# Altium schematic sheet Mandelbrot.SchDoc
size A; DocumentNumber: 1; SheetNumber: 1; SheetTotal: 1
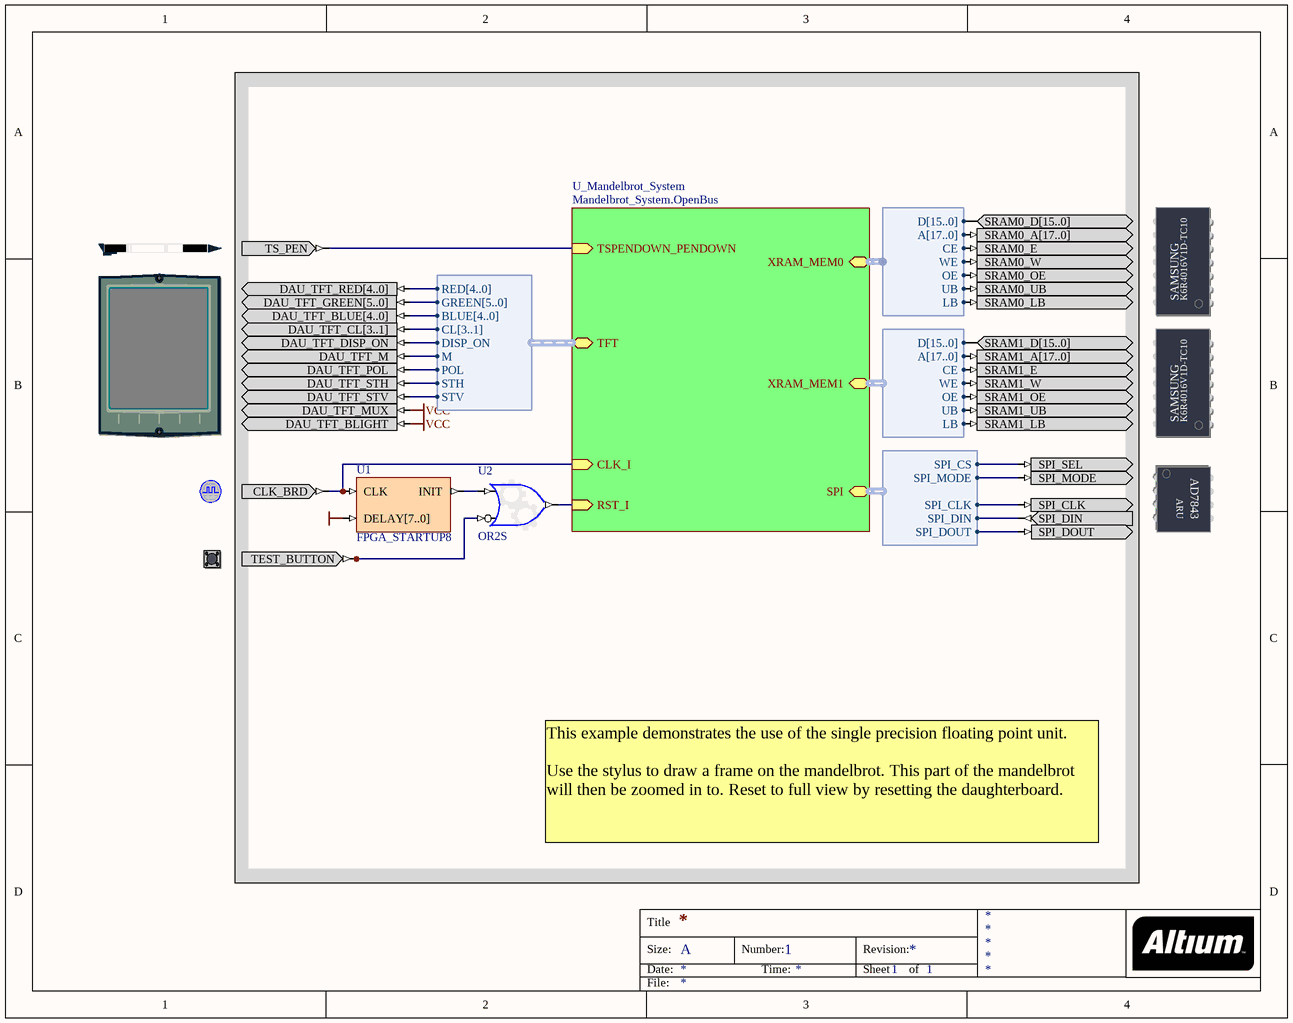
[diagram p0: Mandelbrot.SchDoc]

## Parts
(Parts that share a designator on the sheet are numbered #1, #2 ... from top to bottom, then left to right.)
?#1  SRAM_DAUGHTER0  (value not drawn)
?#2  TOUCHSCREEN_PEN_DOWN  (value not drawn)
?#3  TFT_LCD  (value not drawn)
?#4  SRAM_DAUGHTER1  (value not drawn)
?#5  CLOCK_BOARD  (value not drawn)
?#6  TEST_BUTTON  (value not drawn)
?#7  TOUCH_SCREEN_DIGITIZER  (value not drawn)
U1  FPGA_STARTUP8
U2  OR2S

## Sub-sheets
U_Mandelbrot_System = Mandelbrot_System.OpenBus: RST_I (in), CLK_I (in), XRAM_MEM1 (harness WB_MEM_CTRL_SRAM16_A18), XRAM_MEM0 (harness WB_MEM_CTRL_SRAM16_A18), TSPENDOWN_PENDOWN (in), SPI (harness SPI_W_NB), TFT (harness VGA32_TFT)

## Harnesses
WB_MEM_CTRL_SRAM16_A18: D[15..0], A[17..0], CE, WE, OE, UB, LB
VGA32_TFT: RED[4..0], GREEN[5..0], BLUE[4..0], CL[3..1], DISP_ON, M, POL, STH, STV
SPI_W_NB: SPI_DOUT, SPI_DIN, SPI_CLK, SPI_MODE, SPI_CS

## Nets
VCC: ?#3.DAU_TFT_BLIGHT ?#3.DAU_TFT_MUX
VCCBUS[..]: U1.DELAY[7..0]
Net?#1_SRAM0_A[17..0]: ?#1.SRAM0_A[17..0] ; sheet U_Mandelbrot_System/XRAM_MEM0.A[17..0]
Net?#1_SRAM0_D[15..0]: ?#1.SRAM0_D[15..0] ; sheet U_Mandelbrot_System/XRAM_MEM0.D[15..0]
Net?#1_SRAM0_E: ?#1.SRAM0_E ; sheet U_Mandelbrot_System/XRAM_MEM0.CE
Net?#1_SRAM0_LB: ?#1.SRAM0_LB ; sheet U_Mandelbrot_System/XRAM_MEM0.LB
Net?#1_SRAM0_OE: ?#1.SRAM0_OE ; sheet U_Mandelbrot_System/XRAM_MEM0.OE
Net?#1_SRAM0_UB: ?#1.SRAM0_UB ; sheet U_Mandelbrot_System/XRAM_MEM0.UB
Net?#1_SRAM0_W: ?#1.SRAM0_W ; sheet U_Mandelbrot_System/XRAM_MEM0.WE
Net?#2_TS_PEN: ?#2.TS_PEN ; sheet U_Mandelbrot_System/TSPENDOWN_PENDOWN
Net?#3_DAU_TFT_BLUE[4..0]: ?#3.DAU_TFT_BLUE[4..0] ; sheet U_Mandelbrot_System/TFT.BLUE[4..0]
Net?#3_DAU_TFT_CL[3..1]: ?#3.DAU_TFT_CL[3..1] ; sheet U_Mandelbrot_System/TFT.CL[3..1]
Net?#3_DAU_TFT_DISP_ON: ?#3.DAU_TFT_DISP_ON ; sheet U_Mandelbrot_System/TFT.DISP_ON
Net?#3_DAU_TFT_GREEN[5..0]: ?#3.DAU_TFT_GREEN[5..0] ; sheet U_Mandelbrot_System/TFT.GREEN[5..0]
Net?#3_DAU_TFT_M: ?#3.DAU_TFT_M ; sheet U_Mandelbrot_System/TFT.M
Net?#3_DAU_TFT_POL: ?#3.DAU_TFT_POL ; sheet U_Mandelbrot_System/TFT.POL
Net?#3_DAU_TFT_RED[4..0]: ?#3.DAU_TFT_RED[4..0] ; sheet U_Mandelbrot_System/TFT.RED[4..0]
Net?#3_DAU_TFT_STH: ?#3.DAU_TFT_STH ; sheet U_Mandelbrot_System/TFT.STH
Net?#3_DAU_TFT_STV: ?#3.DAU_TFT_STV ; sheet U_Mandelbrot_System/TFT.STV
Net?#4_SRAM1_A[17..0]: ?#4.SRAM1_A[17..0] ; sheet U_Mandelbrot_System/XRAM_MEM1.A[17..0]
Net?#4_SRAM1_D[15..0]: ?#4.SRAM1_D[15..0] ; sheet U_Mandelbrot_System/XRAM_MEM1.D[15..0]
Net?#4_SRAM1_E: ?#4.SRAM1_E ; sheet U_Mandelbrot_System/XRAM_MEM1.CE
Net?#4_SRAM1_LB: ?#4.SRAM1_LB ; sheet U_Mandelbrot_System/XRAM_MEM1.LB
Net?#4_SRAM1_OE: ?#4.SRAM1_OE ; sheet U_Mandelbrot_System/XRAM_MEM1.OE
Net?#4_SRAM1_UB: ?#4.SRAM1_UB ; sheet U_Mandelbrot_System/XRAM_MEM1.UB
Net?#4_SRAM1_W: ?#4.SRAM1_W ; sheet U_Mandelbrot_System/XRAM_MEM1.WE
Net?#5_CLK_BRD: ?#5.CLK_BRD U1.CLK ; sheet U_Mandelbrot_System/CLK_I
Net?#6_TEST_BUTTON: ?#6.TEST_BUTTON U2.I1
Net?#7_SPI_CLK: ?#7.SPI_CLK ; sheet U_Mandelbrot_System/SPI.SPI_CLK
Net?#7_SPI_DIN: ?#7.SPI_DIN ; sheet U_Mandelbrot_System/SPI.SPI_DIN
Net?#7_SPI_DOUT: ?#7.SPI_DOUT ; sheet U_Mandelbrot_System/SPI.SPI_DOUT
Net?#7_SPI_MODE: ?#7.SPI_MODE ; sheet U_Mandelbrot_System/SPI.SPI_MODE
Net?#7_SPI_SEL: ?#7.SPI_SEL ; sheet U_Mandelbrot_System/SPI.SPI_CS
NetU1_INIT: U1.INIT U2.I0
NetU2_O: U2.O ; sheet U_Mandelbrot_System/RST_I

## Notes on the sheet
- This example demonstrates the use of the single precision floating point unit.
  Use the stylus to draw a frame on the mandelbrot. This part of the mandelbrot will then be zoomed in to. Reset to full view by resetting the daughterboard.
- Title
- Size:
- Date:
- A
- Number:
- Time:
- Revision:
- Sheet
- of
- File:
- (in symbol SRAM_DAUGHTER0) SAMSUNG; K6R4016V1D-TC10
- (in symbol SRAM_DAUGHTER1) SAMSUNG; K6R4016V1D-TC10
- (in symbol TOUCH_SCREEN_DIGITIZER) AD7843; ARU

## Library data of the parts
?#1 = SRAM_DAUGHTER0: Free Static RAM - Daughterboard; PortComponent: True; Published: 14-May-2007; Publisher: Altium Limited; HelpURL: TR0143 NanoBoard Technical Reference Manual - NB2.pdf#page=24
?#2 = TOUCH_SCREEN_PEN: TFT Touch Screen Pen; PortComponent: True; Published: 22-Jan-2007; Publisher: Altium Limited; HelpURL: TR0143 Technical Reference Manual for Altium's Desktop NanoBoard NB2DSK01.pdf#page=50
?#3 = TFT_LCD: TFT LCD Panel; PortComponent: True; Published: 22-Jan-2007; Publisher: Altium Limited; HelpURL: TR0143 Technical Reference Manual for Altium's Desktop NanoBoard NB2DSK01.pdf#page=50
?#4 = SRAM_DAUGHTER1: Free Static RAM - Daughterboard; PortComponent: True; Published: 14-May-2007; Publisher: Altium Limited; HelpURL: TR0143 NanoBoard Technical Reference Manual - NB2.pdf#page=24
?#5 = CLOCK_BOARD: Global System Clock Supply; PortComponent: True; Published: 19-Nov-2003; Publisher: Altium Limited; HelpURL: TR0143 NanoBoard Technical Reference Manual - NB2.pdf#page=36
?#6 = TEST_BUTTON: Test / Reset Button; PortComponent: True; Published: 19-Nov-2003; Publisher: Altium Limited; HelpURL: TR0143 NanoBoard Technical Reference Manual - NB2.pdf#page=47
?#7 = TOUCH_SCREEN_DIGITIZER: Touch Screen Digitizer; PortComponent: True; Published: 22-Jan-2007; Publisher: Altium Limited; HelpURL: TR0143 Technical Reference Manual for Altium's Desktop NanoBoard NB2DSK01.pdf#page=50
U1 = FPGA_STARTUP8: FPGA Startup With 8 Bit Delay; Published: 9-Dec-2004; Publisher: Altium Limited; HelpURL: CR0119 FPGA_STARTUPx Powerup Delay Unit.pdf; LastRevisionNo: 1.00.00; ComponentLink1Description: Core &Resource Usage; ComponentLink1URL: CR0139 FPGA Peripheral Resource Usage.pdf#page=10
U2 = GATE: Configurable Generic Gate; ConfiguratorName: GENERIC_GATE; ConfigurationParameters: {}Version[1.0]{}GateKind[OR]{}BusInput[False]{}GateInputType[Bit]{}GateOutputOption[Normal]{}BusWidth[8]{}RegisterOutputs[False]{}NegativeClockEdge[False]{}InputCount[2]{}InputInvert0[False]{}InputInvert1[True]{}; LastRevisionNo: 1.00.00; Published: 3-Sep-2008; Publisher: Altium Limited